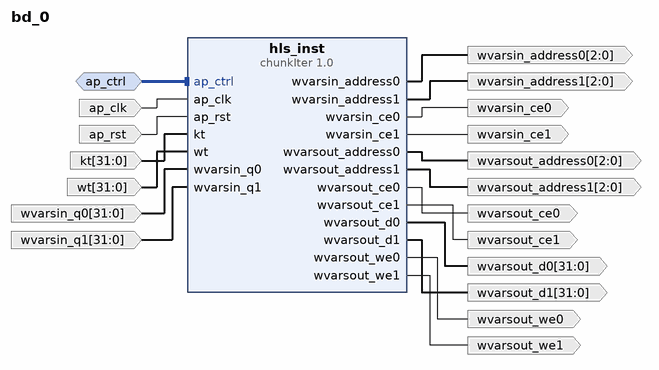
[diagram p0: block diagram of the top level]
# Vivado block design bd_0, xa7s6cpga196-2I, Vivado 2025.1
create_bd_design bd_0

create_bd_intf_port -mode Slave -vlnv xilinx.com:interface:acc_handshake_rtl:1.0 ap_ctrl
create_bd_port -dir I -type clk ap_clk
set_property -dict {CONFIG.FREQ_HZ 100000000.0} [get_bd_ports ap_clk]
create_bd_port -dir I -type rst ap_rst
set_property -dict {CONFIG.POLARITY ACTIVE_HIGH} [get_bd_ports ap_rst]
create_bd_port -dir I -from 31 -to 0 -type data kt
create_bd_port -dir I -from 31 -to 0 -type data wt
create_bd_port -dir O -from 2 -to 0 -type data wvarsin_address0
create_bd_port -dir O -from 2 -to 0 -type data wvarsin_address1
create_bd_port -dir O wvarsin_ce0
create_bd_port -dir O wvarsin_ce1
create_bd_port -dir I -from 31 -to 0 -type data wvarsin_q0
create_bd_port -dir I -from 31 -to 0 -type data wvarsin_q1
create_bd_port -dir O -from 2 -to 0 -type data wvarsout_address0
create_bd_port -dir O -from 2 -to 0 -type data wvarsout_address1
create_bd_port -dir O wvarsout_ce0
create_bd_port -dir O wvarsout_ce1
create_bd_port -dir O -from 31 -to 0 -type data wvarsout_d0
create_bd_port -dir O -from 31 -to 0 -type data wvarsout_d1
create_bd_port -dir O wvarsout_we0
create_bd_port -dir O wvarsout_we1

create_bd_cell -type ip -vlnv xilinx.com:hls:chunkIter:1.0 hls_inst

# ---- connections ----

connect_bd_intf_net -intf_net ap_ctrl_0_1 [get_bd_intf_ports ap_ctrl] [get_bd_intf_pins hls_inst/ap_ctrl]
connect_bd_net -net ap_clk_0_1 [get_bd_ports ap_clk] [get_bd_pins hls_inst/ap_clk]
connect_bd_net -net ap_rst_0_1 [get_bd_ports ap_rst] [get_bd_pins hls_inst/ap_rst]
connect_bd_net [get_bd_pins hls_inst/wvarsin_address0] [get_bd_ports wvarsin_address0]
connect_bd_net [get_bd_pins hls_inst/wvarsin_address1] [get_bd_ports wvarsin_address1]
connect_bd_net [get_bd_pins hls_inst/wvarsin_ce0] [get_bd_ports wvarsin_ce0]
connect_bd_net [get_bd_pins hls_inst/wvarsin_ce1] [get_bd_ports wvarsin_ce1]
connect_bd_net [get_bd_pins hls_inst/wvarsout_address0] [get_bd_ports wvarsout_address0]
connect_bd_net [get_bd_pins hls_inst/wvarsout_address1] [get_bd_ports wvarsout_address1]
connect_bd_net [get_bd_pins hls_inst/wvarsout_ce0] [get_bd_ports wvarsout_ce0]
connect_bd_net [get_bd_pins hls_inst/wvarsout_ce1] [get_bd_ports wvarsout_ce1]
connect_bd_net [get_bd_pins hls_inst/wvarsout_d0] [get_bd_ports wvarsout_d0]
connect_bd_net [get_bd_pins hls_inst/wvarsout_d1] [get_bd_ports wvarsout_d1]
connect_bd_net [get_bd_pins hls_inst/wvarsout_we0] [get_bd_ports wvarsout_we0]
connect_bd_net [get_bd_pins hls_inst/wvarsout_we1] [get_bd_ports wvarsout_we1]
connect_bd_net -net kt_0_1 [get_bd_ports kt] [get_bd_pins hls_inst/kt]
connect_bd_net -net wt_0_1 [get_bd_ports wt] [get_bd_pins hls_inst/wt]
connect_bd_net -net wvarsin_q0_0_1 [get_bd_ports wvarsin_q0] [get_bd_pins hls_inst/wvarsin_q0]
connect_bd_net -net wvarsin_q1_0_1 [get_bd_ports wvarsin_q1] [get_bd_pins hls_inst/wvarsin_q1]

validate_bd_design
save_bd_design
